# EAGLE board trig3_board_trigger_waveshare_lvds (EAGLE 9.6.2), part 1 of 2
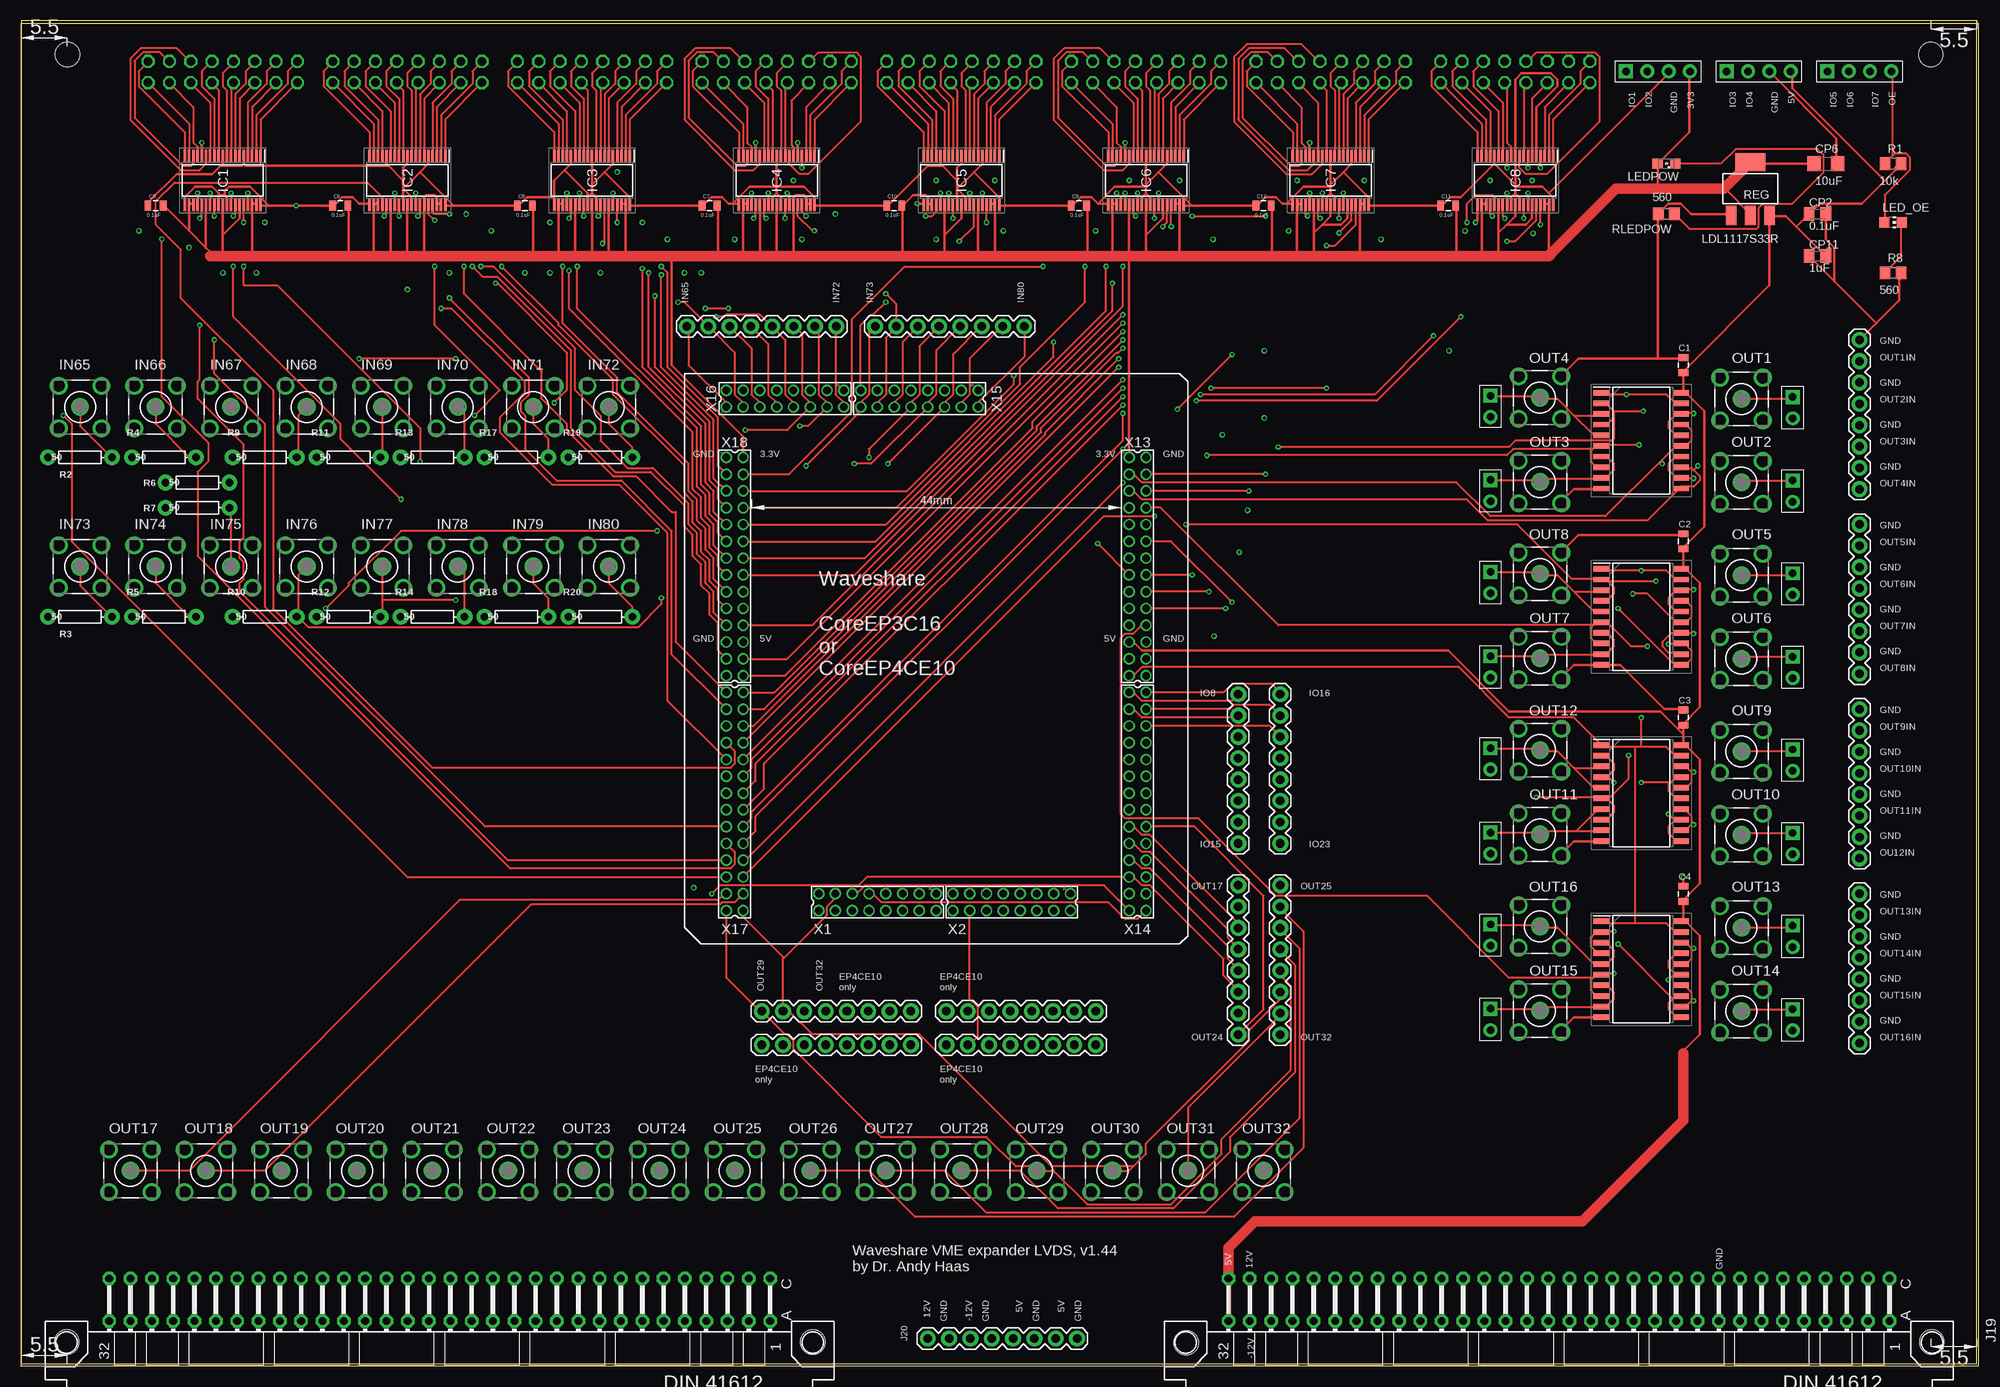
[diagram p3: board, top side]
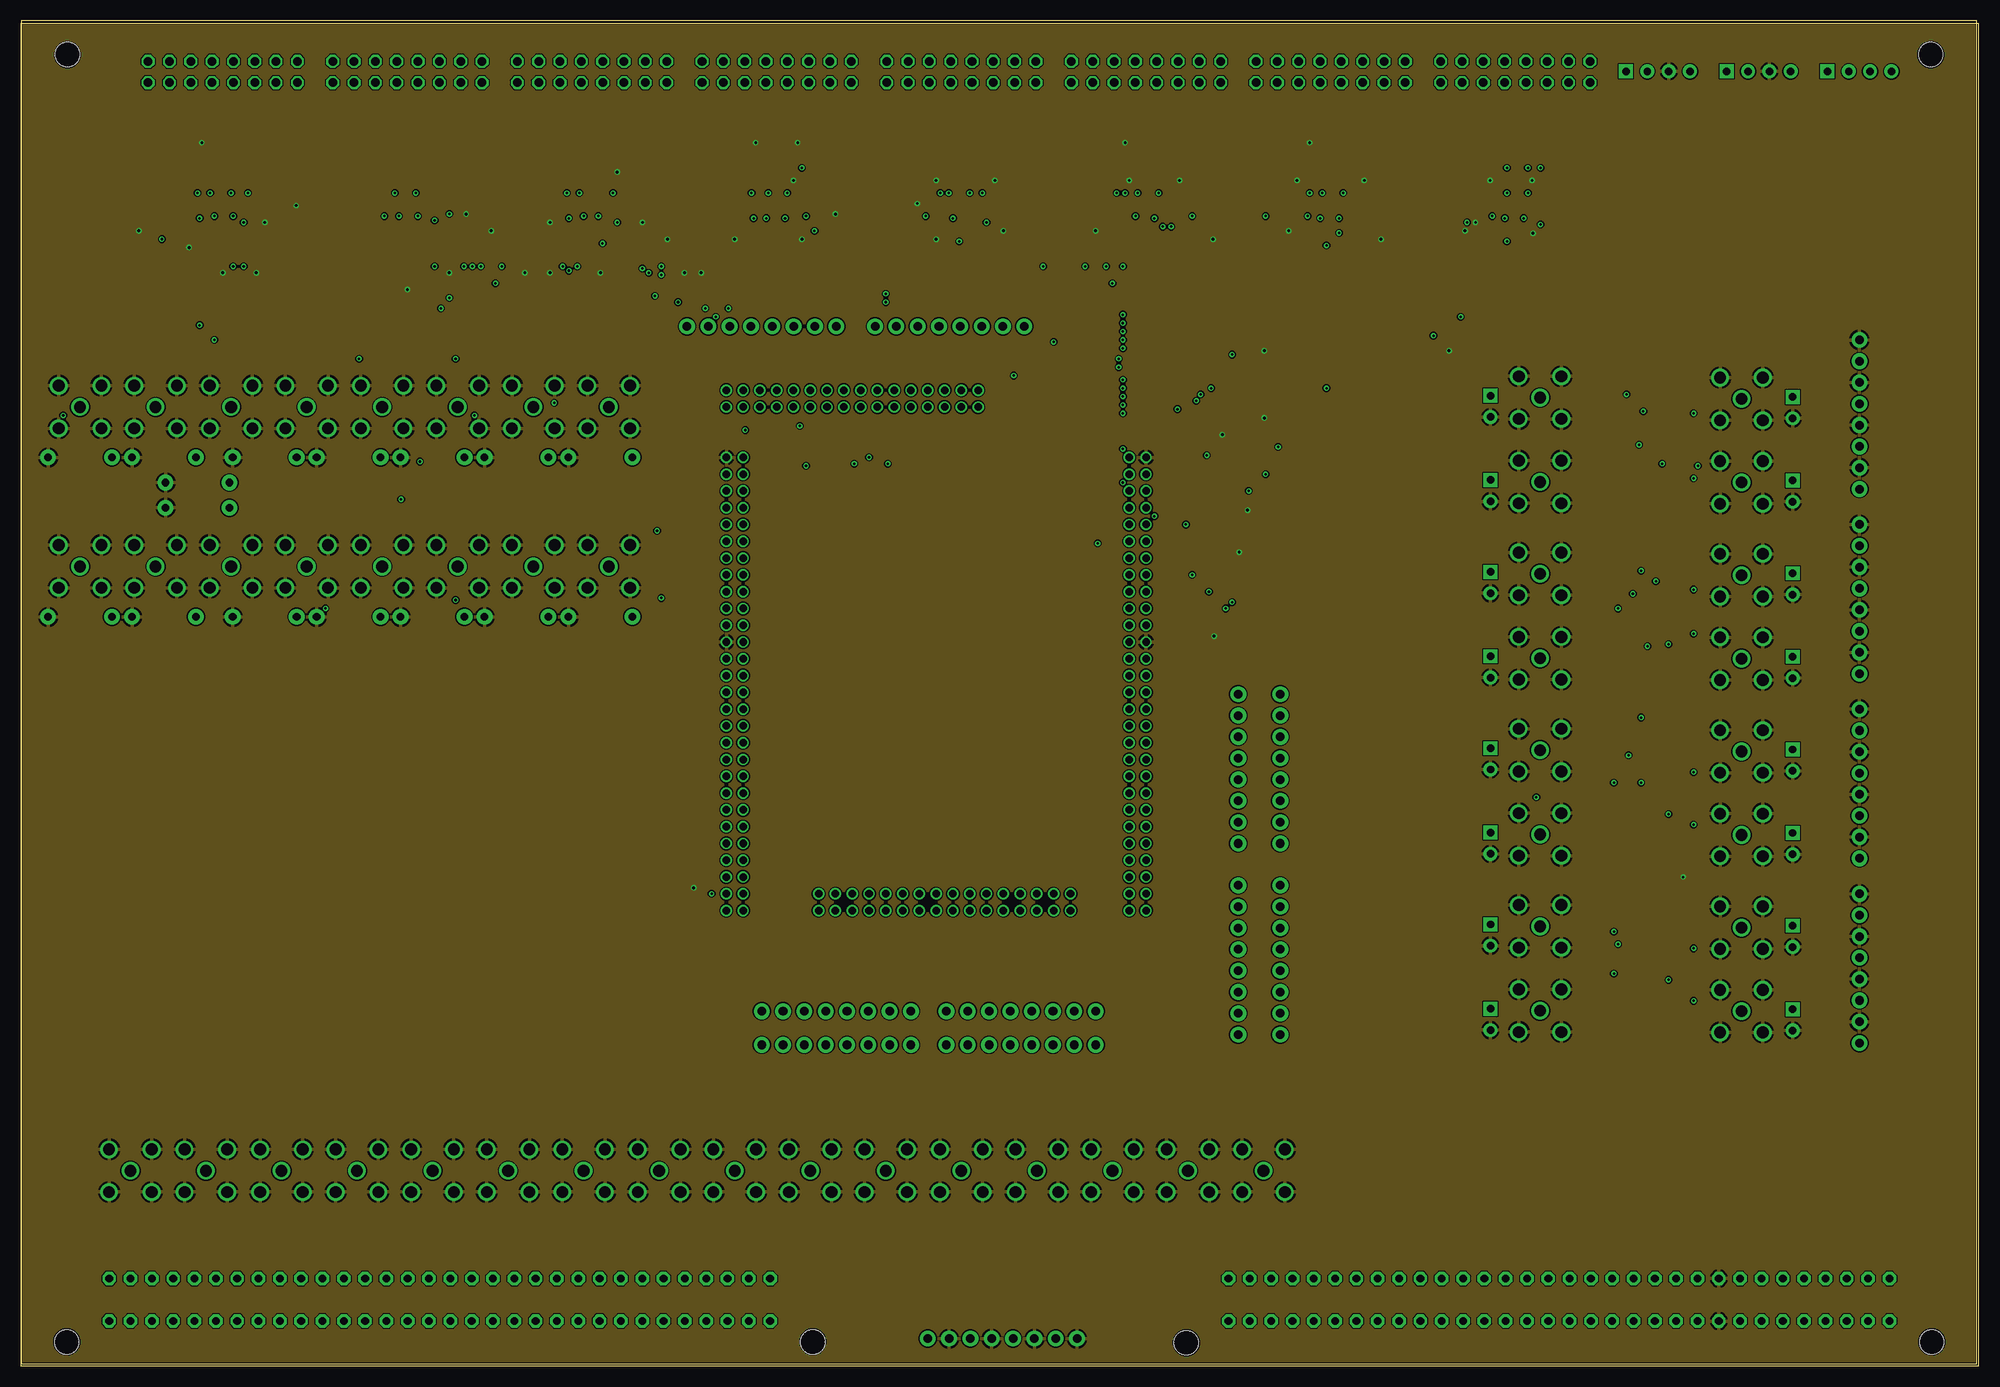
[diagram p4: board, inner layer topgnd]
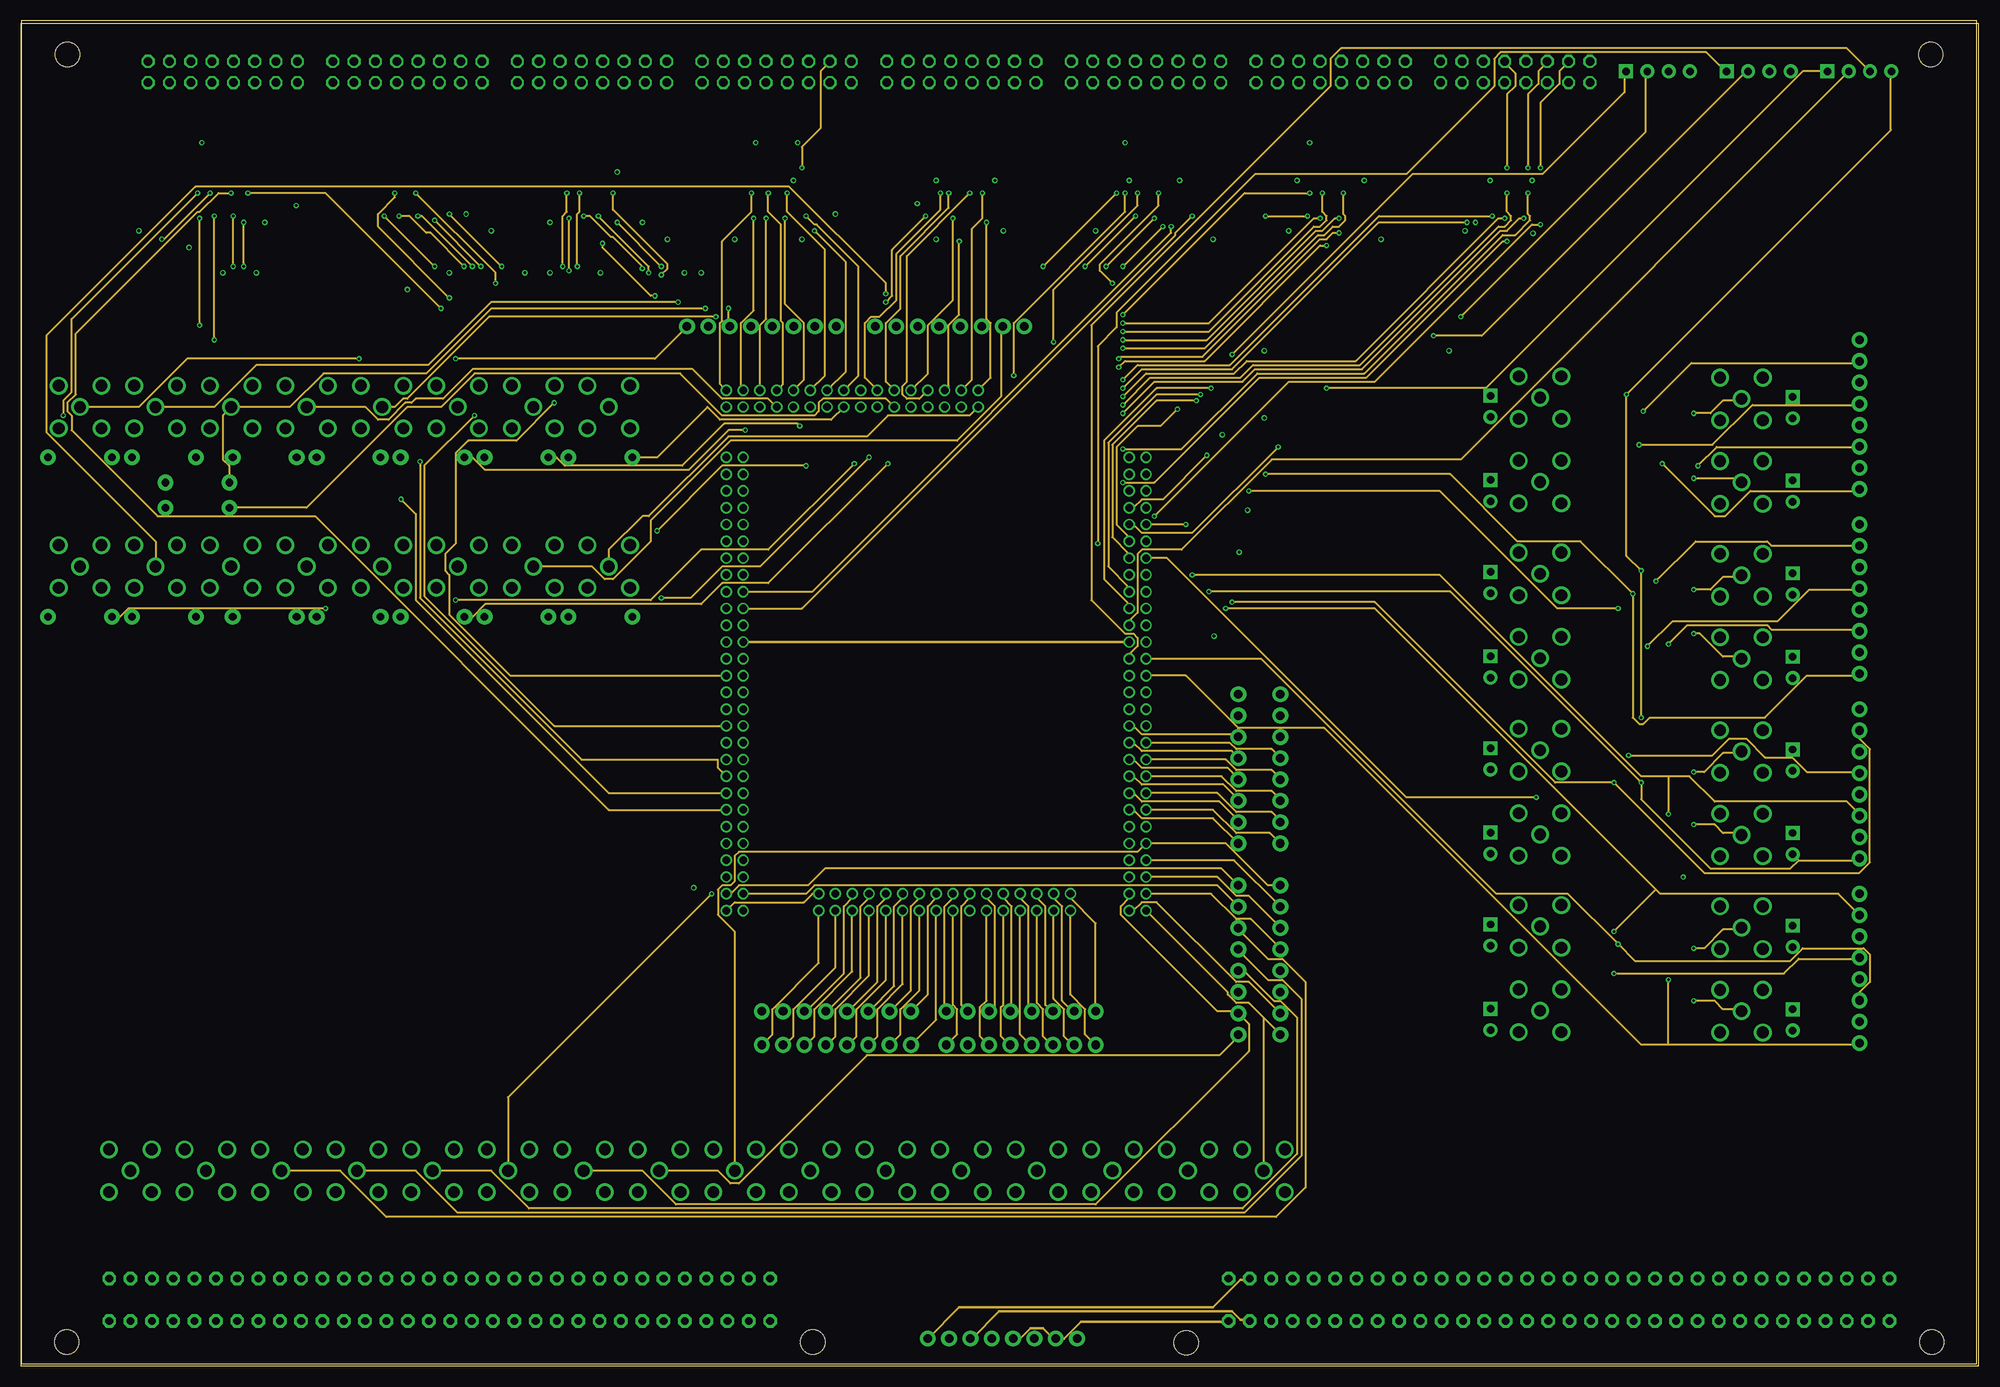
[diagram p5: board, inner layer route]
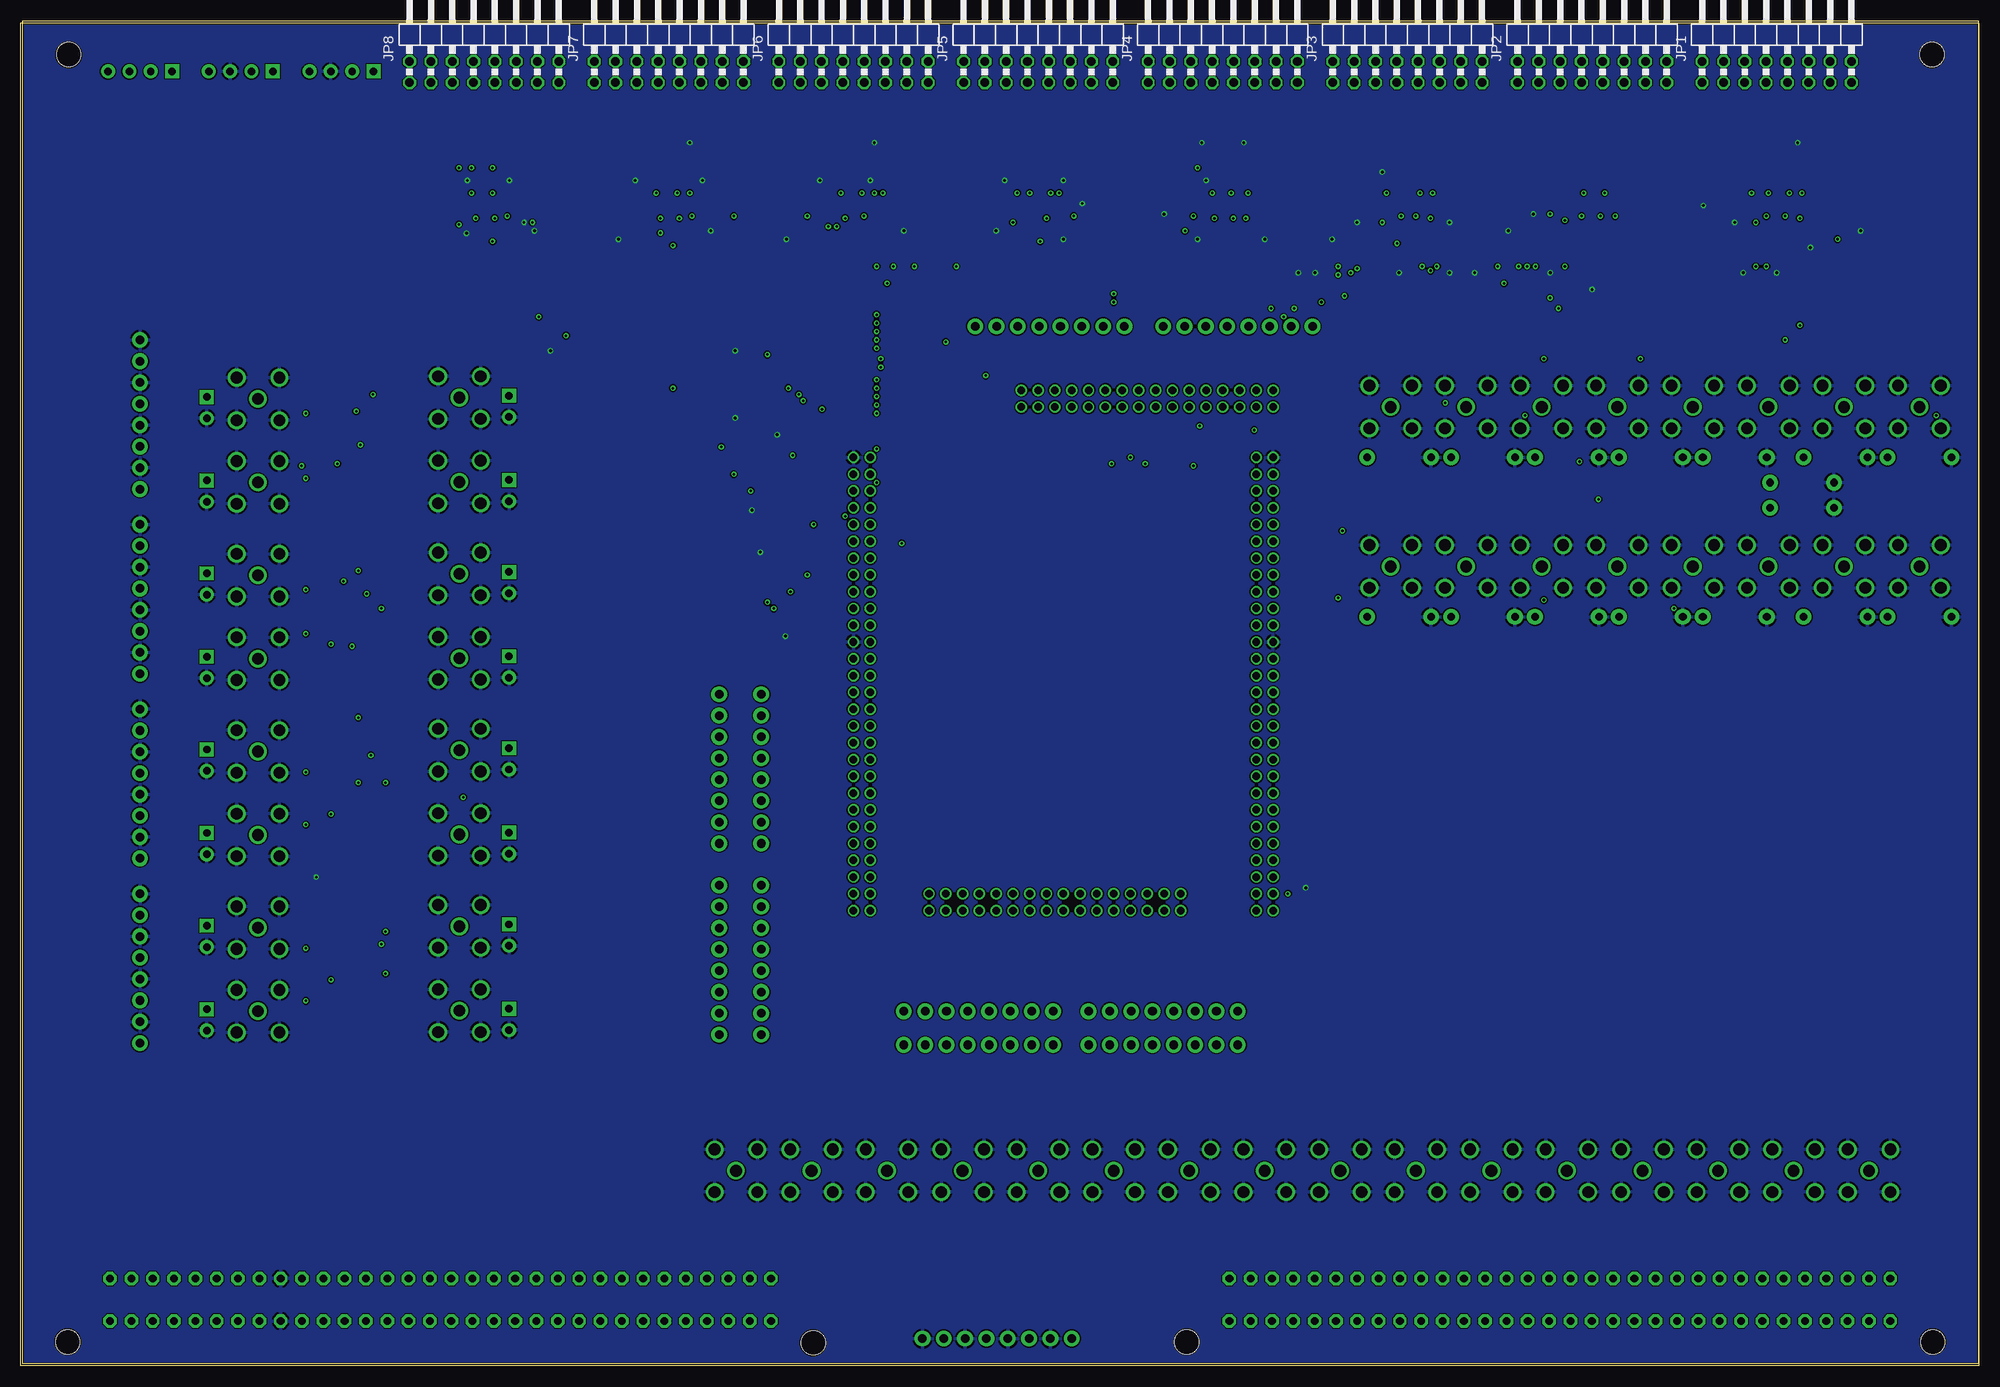
[diagram p6: board, bottom side, seen from below]

Size 233 x 160 mm. Coordinates in mm from the lower left corner, seen from the top.
Outline: 0,160 0,0 233,0 233,160 0,160
Copper layers (1*2*15*16): top 0.035mm / dielectric 0.2mm / topgnd 0.0175mm / dielectric 0.3mm / route 0.0175mm / dielectric 0.2mm / gnd 0.035mm
Design rules "Seeed_AllPCB_MacroFab_haas6mil": minimum track width 6mil, minimum drill 12mil, track to track 6mil, track to pad 6mil, pad to pad 6mil, via to via 6mil, smd to smd 0mil, copper to edge 6mil, drill to drill 6mil, minimum pad ring 6mil, minimum via ring 6mil, stop-mask expansion 6mil, vias tented up to drill 25mil, thermal gap 10mil
Net classes: 0 default: width 0.254 mm; 1 power: width 0.305 mm
Holes 2.9 mm at 5.4,2.6 138.8,2.5 227.6,2.6 94.3,2.6 5.5,156 227.5,156

## Footprints (pad centres in the part's own frame; a part is rotated, then mirrored left to right if it is on the bottom)
0805 = smd 0.8 x 1.2: 1 -0.9,0; 2 0.9,0
C0805K = smd 1.3 x 1.6: 1 -1,0; 2 1,0
C1206 = smd 1.6 x 1.8: 1 -1.4,0; 2 1.4,0
SOP50P640X120-38N = smd 1.475 x 0.3: 1 -2.938,4.5; 2 -2.938,4; 3 -2.938,3.5; 4 -2.938,3; 5 -2.938,2.5; 6 -2.938,2; 7 -2.938,1.5; 8 -2.938,1; 9 -2.938,0.5; 10 -2.938,0; 11 -2.938,-0.5; 12 -2.938,-1; 13 -2.938,-1.5; 14 -2.938,-2; 15 -2.938,-2.5; 16 -2.938,-3; 17 -2.938,-3.5; 18 -2.938,-4; 19 -2.938,-4.5; 20 2.938,-4.5; 21 2.938,-4; 22 2.938,-3.5; 23 2.938,-3; 24 2.938,-2.5; 25 2.938,-2; 26 2.938,-1.5; 27 2.938,-1; 28 2.938,-0.5; 29 2.938,0; 30 2.938,0.5; 31 2.938,1; 32 2.938,1.5; 33 2.938,2; 34 2.938,2.5; 35 2.938,3; 36 2.938,3.5; 37 2.938,4; 38 2.938,4.5
BU-SMB-V = drill 1.4: 1 0,0; 2 -2.54,2.54; 3 2.54,2.54; 4 2.54,-2.54; 5 -2.54,-2.54
1X08 = drill 1.016 pad 1.88: 1 0,0; 2 2.54,0; 3 5.08,0; 4 7.62,0; 5 10.16,0; 6 12.7,0; 7 15.24,0; 8 17.78,0
H4-2.54 = drill 0.889 pad 1.651 square: 1 0,3.81 | drill 0.889 pad 1.651: 2 0,1.27; 3 0,-1.27; 4 0,-3.81
6HE_160-VG64AC = drill 0.914 pad 1.6 octagon: 1-A1 5.08,11.43; 1-A2 5.08,16.51; 1-A3 5.08,13.97; 1-A4 5.08,19.05; 1-A5 5.08,21.59; 1-A6 5.08,24.13; 1-A7 5.08,26.67; 1-A8 5.08,29.21; 1-A9 5.08,31.75; 1-A10 5.08,34.29; 1-A11 5.08,36.83; 1-A12 5.08,39.37; 1-A13 5.08,41.91; 1-A14 5.08,44.45; 1-A15 5.08,46.99; 1-A16 5.08,49.53; 1-A17 5.08,52.07; 1-A18 5.08,54.61; 1-A19 5.08,57.15; 1-A20 5.08,59.69; 1-A21 5.08,62.23; 1-A22 5.08,64.77; 1-A23 5.08,67.31; 1-A24 5.08,69.85; 1-A25 5.08,72.39; 1-A26 5.08,74.93; 1-A27 5.08,77.47; 1-A28 5.08,80.01; 1-A29 5.08,82.55; 1-A30 5.08,85.09; 1-A31 5.08,87.63; 1-A32 5.08,90.17; 1-C1 10.16,11.43; 1-C2 10.16,13.97; 1-C3 10.16,16.51; 1-C4 10.16,19.05; 1-C5 10.16,21.59; 1-C6 10.16,24.13; 1-C7 10.16,26.67; 1-C8 10.16,29.21; 1-C9 10.16,31.75; 1-C10 10.16,34.29; 1-C11 10.16,36.83; 1-C12 10.16,39.37; 1-C13 10.16,41.91; 1-C14 10.16,44.45; 1-C15 10.16,46.99; 1-C16 10.16,49.53; 1-C17 10.16,52.07; 1-C18 10.16,54.61; 1-C19 10.16,57.15; 1-C20 10.16,59.69; 1-C21 10.16,62.23; 1-C22 10.16,64.77; 1-C23 10.16,67.31; 1-C24 10.16,69.85; 1-C25 10.16,72.39; 1-C26 10.16,74.93; 1-C27 10.16,77.47; 1-C28 10.16,80.01; 1-C29 10.16,82.55; 1-C30 10.16,85.09; 1-C31 10.16,87.63; 1-C32 10.16,90.17; 2-A1 5.08,144.78; 2-A2 5.08,147.32; 2-A3 5.08,149.86; 2-A4 5.08,152.4; 2-A5 5.08,154.94; 2-A6 5.08,157.48; 2-A7 5.08,160.02; 2-A8 5.08,162.56; 2-A9 5.08,165.1; 2-A10 5.08,167.64; 2-A11 5.08,170.18; 2-A12 5.08,172.72; 2-A13 5.08,175.26; 2-A14 5.08,177.8; 2-A15 5.08,180.34; 2-A16 5.08,182.88; 2-A17 5.08,185.42; 2-A18 5.08,187.96; 2-A19 5.08,190.5; 2-A20 5.08,193.04; 2-A21 5.08,195.58; 2-A22 5.08,198.12; 2-A23 5.08,200.66; 2-A24 5.08,203.2; 2-A25 5.08,205.74; 2-A26 5.08,208.28; 2-A27 5.08,210.82; 2-A28 5.08,213.36; 2-A29 5.08,215.9; 2-A30 5.08,218.44; 2-A31 5.08,220.98; 2-A32 5.08,223.52; 2-C1 10.16,144.78; 2-C2 10.16,147.32; 2-C3 10.16,149.86; 2-C4 10.16,152.4; 2-C5 10.16,154.94; 2-C6 10.16,157.48; 2-C7 10.16,160.02; 2-C8 10.16,162.56; 2-C9 10.16,165.1; 2-C10 10.16,167.64; 2-C11 10.16,170.18; 2-C12 10.16,172.72; 2-C13 10.16,175.26; 2-C14 10.16,177.8; 2-C15 10.16,180.34; 2-C16 10.16,182.88; 2-C17 10.16,185.42; 2-C18 10.16,187.96; 2-C19 10.16,190.5; 2-C20 10.16,193.04; 2-C21 10.16,195.58; 2-C22 10.16,198.12; 2-C23 10.16,200.66; 2-C24 10.16,203.2; 2-C25 10.16,205.74; 2-C26 10.16,208.28; 2-C27 10.16,210.82; 2-C28 10.16,213.36; 2-C29 10.16,215.9; 2-C30 10.16,218.44; 2-C31 10.16,220.98; 2-C32 10.16,223.52
2X08/90 = drill 1.016 octagon: 1 -8.89,-6.35; 2 -8.89,-3.81; 3 -6.35,-6.35; 4 -6.35,-3.81; 5 -3.81,-6.35; 6 -3.81,-3.81; 7 -1.27,-6.35; 8 -1.27,-3.81; 9 1.27,-6.35; 10 1.27,-3.81; 11 3.81,-6.35; 12 3.81,-3.81; 13 6.35,-6.35; 14 6.35,-3.81; 15 8.89,-6.35; 16 8.89,-3.81
CHIP-LED0805 = smd 1.2 x 1.2: A 0,-1.05; C 0,1.05
SML0805 = smd 1.2 x 1.2: A 1.05,0; C -1.05,0
H2-2.54 = drill 0.889 pad 1.651 square: 1 0,1.27 | drill 0.889 pad 1.651: 2 0,-1.27
R0805 = smd 1.3 x 1.5: 1 -0.95,0; 2 0.95,0
AXIAL-0.3 = drill 0.9 pad 1.88: P$1 -3.81,0; P$2 3.81,0
SOT-223 = smd 1.27 x 2.286: 1 -2.286,-3.175; 2 0,-3.175; 3 2.286,-3.175 | smd 3.556 x 2.159: TER 0,3.175
SOIC127P1030X265-20N = smd 1.95 x 0.65: 1 -4.725,5.715; 2 -4.725,4.445; 3 -4.725,3.175; 4 -4.725,1.905; 5 -4.725,0.635; 6 -4.725,-0.635; 7 -4.725,-1.905; 8 -4.725,-3.175; 9 -4.725,-4.445; 10 -4.725,-5.715; 11 4.725,-5.715; 12 4.725,-4.445; 13 4.725,-3.175; 14 4.725,-1.905; 15 4.725,-0.635; 16 4.725,0.635; 17 4.725,1.905; 18 4.725,3.175; 19 4.725,4.445; 20 4.725,5.715
87758-1616 = drill 0.9 pad 1.27: 1 -7,-1; 2 -7,1; 3 -5,-1; 4 -5,1; 5 -3,-1; 6 -3,1; 7 -1,-1; 8 -1,1; 9 1,-1; 10 1,1; 11 3,-1; 12 3,1; 13 5,-1; 14 5,1; 15 7,-1; 16 7,1
87758-2816 = drill 0.9 pad 1.27: 1 -13,-1; 2 -13,1; 3 -11,-1; 4 -11,1; 5 -9,-1; 6 -9,1; 7 -7,-1; 8 -7,1; 9 -5,-1; 10 -5,1; 11 -3,-1; 12 -3,1; 13 -1,-1; 14 -1,1; 15 1,-1; 16 1,1; 17 3,-1; 18 3,1; 19 5,-1; 20 5,1; 21 7,-1; 22 7,1; 23 9,-1; 24 9,1; 25 11,-1; 26 11,1; 27 13,-1; 28 13,1

## Placement (x,y rotation side)
C1  0.1uF  [0805]  198,119 270 top
C2  0.1uF  [0805]  198,98 270 top
C3  0.1uF  [0805]  198,77 270 top
C4  0.1uF  [0805]  198,56 270 top
C5  0.1uF  [0805]  16,138 0 top
C6  0.1uF  [0805]  38,138 0 top
C7  0.1uF  [0805]  82,138 0 top
C8  0.1uF  [0805]  60,138 0 top
C9  0.1uF  [0805]  126,138 0 top
C10  0.1uF  [0805]  104,138 0 top
C11  0.1uF  [0805]  170,138 0 top
C12  0.1uF  [0805]  148,138 0 top
CP2  0.1uF  [C0805K]  214,137 0 top
CP6  10uF  [C1206]  215,143 0 top
CP11  1uF  [C0805K]  214,132 0 top
IC1  SN65LVDT388ADBT  [SOP50P640X120-38N]  24,141 270 top
IC2  SN65LVDT388ADBT  [SOP50P640X120-38N]  46,141 270 top
IC3  SN65LVDT388ADBT  [SOP50P640X120-38N]  68,141 270 top
IC4  SN65LVDT388ADBT  [SOP50P640X120-38N]  90,141 270 top
IC5  SN65LVDT388ADBT  [SOP50P640X120-38N]  112,141 270 top
IC6  SN65LVDT388ADBT  [SOP50P640X120-38N]  134,141 270 top
IC7  SN65LVDT388ADBT  [SOP50P640X120-38N]  156,141 270 top
IC8  SN65LVDT388ADBT  [SOP50P640X120-38N]  178,141 270 top
IN65  BU-SMB-V  [BU-SMB-V]  7,114 0 top
IN66  BU-SMB-V  [BU-SMB-V]  16,114 0 top
IN67  BU-SMB-V  [BU-SMB-V]  25,114 0 top
IN68  BU-SMB-V  [BU-SMB-V]  34,114 0 top
IN69  BU-SMB-V  [BU-SMB-V]  43,114 0 top
IN70  BU-SMB-V  [BU-SMB-V]  52,114 0 top
IN71  BU-SMB-V  [BU-SMB-V]  61,114 0 top
IN72  BU-SMB-V  [BU-SMB-V]  70,114 0 top
IN73  BU-SMB-V  [BU-SMB-V]  7,95 0 top
IN74  BU-SMB-V  [BU-SMB-V]  16,95 0 top
IN75  BU-SMB-V  [BU-SMB-V]  25,95 0 top
IN76  BU-SMB-V  [BU-SMB-V]  34,95 0 top
IN77  BU-SMB-V  [BU-SMB-V]  43,95 0 top
IN78  BU-SMB-V  [BU-SMB-V]  52,95 0 top
IN79  BU-SMB-V  [BU-SMB-V]  61,95 0 top
IN80  BU-SMB-V  [BU-SMB-V]  70,95 0 top
J1  8pin  [1X08]  219,122 270 top
J2  8pin  [1X08]  219,78 270 top
J3  4p-2.54  [H4-2.54]  219,154 90 top
J4  4p-2.54  [H4-2.54]  207,154 90 top
J5  8pin  [1X08]  219,56 270 top
J6  8pin  [1X08]  219,100 270 top
J7  8pin  [1X08]  97.1,123.6 180 top
J8  8pin  [1X08]  119.5,123.6 180 top
J9  8pin  [1X08]  106,42 180 top
J10  8pin  [1X08]  128,42 180 top
J11  8pin  [1X08]  106,38 180 top
J12  4p-2.54  [H4-2.54]  195,154 90 top
J13  8pin  [1X08]  128,38 180 top
J14  8pin  [1X08]  145,62 90 top
J15  8pin  [1X08]  150,62 90 top
J16  8pin  [1X08]  150,57 270 top
J17  8pin  [1X08]  145,57 270 top
J19  6HE-160-VG64AC  [6HE_160-VG64AC]  234,0 90 top
J20  8pin  [1X08]  108,3 0 top
JP1  16  [2X08/90]  24,159 0 bottom
JP2  16  [2X08/90]  46,159 0 bottom
JP3  16  [2X08/90]  68,159 0 bottom
JP4  16  [2X08/90]  90,159 0 bottom
JP5  16  [2X08/90]  112,159 0 bottom
JP6  16  [2X08/90]  134,159 0 bottom
JP7  16  [2X08/90]  156,159 0 bottom
JP8  16  [2X08/90]  178,159 0 bottom
LED_OE  OutputEn  [CHIP-LED0805]  223,136 270 top
LEDPOW  MF-LED-0805-RED  [SML0805]  196,143 180 top
OJ1  2p-2.54  [H2-2.54]  211.04,113.93 0 top
OJ2  2p-2.54  [H2-2.54]  211.04,103.98 0 top
OJ3  2p-2.54  [H2-2.54]  175.04,104.03 0 top
OJ4  2p-2.54  [H2-2.54]  175.04,114.08 0 top
OJ9  2p-2.54  [H2-2.54]  175.04,93.08 0 top
OJ10  2p-2.54  [H2-2.54]  175.04,83.03 0 top
OJ11  2p-2.54  [H2-2.54]  211.04,82.98 0 top
OJ12  2p-2.54  [H2-2.54]  211.04,92.93 0 top
OJ13  2p-2.54  [H2-2.54]  175.04,72.08 0 top
OJ14  2p-2.54  [H2-2.54]  175.04,62.03 0 top
OJ15  2p-2.54  [H2-2.54]  211.04,61.98 0 top
OJ16  2p-2.54  [H2-2.54]  211.04,71.93 0 top
OJ17  2p-2.54  [H2-2.54]  175.04,51.08 0 top
OJ18  2p-2.54  [H2-2.54]  175.04,41.03 0 top
OJ19  2p-2.54  [H2-2.54]  211.04,40.98 0 top
OJ20  2p-2.54  [H2-2.54]  211.04,50.93 0 top
OUT1  BU-SMB-V  [BU-SMB-V]  204.95,114.96 90 top
OUT2  BU-SMB-V  [BU-SMB-V]  204.95,105.02 90 top
OUT3  BU-SMB-V  [BU-SMB-V]  180.95,105.07 90 top
OUT4  BU-SMB-V  [BU-SMB-V]  180.95,115.12 90 top
OUT5  BU-SMB-V  [BU-SMB-V]  204.95,93.96 90 top
OUT6  BU-SMB-V  [BU-SMB-V]  204.95,84.02 90 top
OUT7  BU-SMB-V  [BU-SMB-V]  180.95,84.07 90 top
OUT8  BU-SMB-V  [BU-SMB-V]  180.95,94.12 90 top
OUT9  BU-SMB-V  [BU-SMB-V]  204.95,72.96 90 top
OUT10  BU-SMB-V  [BU-SMB-V]  204.95,63.02 90 top
OUT11  BU-SMB-V  [BU-SMB-V]  180.95,63.07 90 top
OUT12  BU-SMB-V  [BU-SMB-V]  180.95,73.12 90 top
OUT13  BU-SMB-V  [BU-SMB-V]  204.95,51.96 90 top
OUT14  BU-SMB-V  [BU-SMB-V]  204.95,42.02 90 top
OUT15  BU-SMB-V  [BU-SMB-V]  180.95,42.07 90 top
OUT16  BU-SMB-V  [BU-SMB-V]  180.95,52.12 90 top
OUT17  BU-SMB-V  [BU-SMB-V]  13,23 0 top
OUT18  BU-SMB-V  [BU-SMB-V]  22,23 0 top
OUT19  BU-SMB-V  [BU-SMB-V]  31,23 0 top
OUT20  BU-SMB-V  [BU-SMB-V]  40,23 0 top
OUT21  BU-SMB-V  [BU-SMB-V]  49,23 0 top
OUT22  BU-SMB-V  [BU-SMB-V]  58,23 0 top
OUT23  BU-SMB-V  [BU-SMB-V]  67,23 0 top
OUT24  BU-SMB-V  [BU-SMB-V]  76,23 0 top
OUT25  BU-SMB-V  [BU-SMB-V]  85,23 0 top
OUT26  BU-SMB-V  [BU-SMB-V]  94,23 0 top
OUT27  BU-SMB-V  [BU-SMB-V]  103,23 0 top
OUT28  BU-SMB-V  [BU-SMB-V]  112,23 0 top
OUT29  BU-SMB-V  [BU-SMB-V]  121,23 0 top
OUT30  BU-SMB-V  [BU-SMB-V]  130,23 0 top
OUT31  BU-SMB-V  [BU-SMB-V]  139,23 0 top
OUT32  BU-SMB-V  [BU-SMB-V]  148,23 0 top
R1  10k  [R0805]  223,143 0 top
R2  50  [AXIAL-0.3]  7,108 0 top
R3  50  [AXIAL-0.3]  7,89 0 top
R4  50  [AXIAL-0.3]  17,108 0 top
R5  50  [AXIAL-0.3]  17,89 0 top
R6  50  [AXIAL-0.3]  21,105 0 top
R7  50  [AXIAL-0.3]  21,102 0 top
R8  560  [R0805]  223,130 0 top
R9  50  [AXIAL-0.3]  29,108 0 top
R10  50  [AXIAL-0.3]  29,89 0 top
R11  50  [AXIAL-0.3]  39,108 0 top
R12  50  [AXIAL-0.3]  39,89 0 top
R13  50  [AXIAL-0.3]  49,108 0 top
R14  50  [AXIAL-0.3]  49,89 0 top
R17  50  [AXIAL-0.3]  59,108 0 top
R18  50  [AXIAL-0.3]  59,89 0 top
R19  50  [AXIAL-0.3]  69,108 0 top
R20  50  [AXIAL-0.3]  69,89 0 top
REG  LDL1117S33R  [SOT-223]  206,140 0 top
RLEDPOW  560  [R0805]  196,137 180 top
VSLUE  SN74ACT244DW  [SOIC127P1030X265-20N]  193,110 0 top
VSLUE2  SN74ACT244DW  [SOIC127P1030X265-20N]  193,89 0 top
VSLUE3  SN74ACT244DW  [SOIC127P1030X265-20N]  193,68 0 top
VSLUE4  SN74ACT244DW  [SOIC127P1030X265-20N]  193,47 0 top
X1  87758-1616  [87758-1616]  102,55 0 top
X2  87758-1616  [87758-1616]  118,55 0 top
X13  87758-2816  [87758-2816]  133,95 270 top
X14  87758-2816  [87758-2816]  133,67 270 top
X15  87758-1616  [87758-1616]  107,115 0 top
X16  87758-1616  [87758-1616]  91,115 0 top
X17  87758-2816  [87758-2816]  85,67 270 top
X18  87758-2816  [87758-2816]  85,95 270 top

## Tracks (layer width: path | path; a pad name or v marks a point on that pad's centre or on a via)
3V3
  top 0.305: IC8.36 181.5,138.25 182,138.25 IC8.37 182,132.75 182.38,132.38 | IC8.22 174.5,138.25 174,138.25 IC8.21 174,132 | IC7.37 160,138.25 159.5,138.25 IC7.36 159.5,132 | IC7.22 152.5,138.25 152,138.25 IC7.21 152,132 | IC6.36 137.5,138.25 138,138.25 IC6.37 138,132 | IC6.22 130.5,138.25 130,138.25 IC6.21 130,132 | IC5.36 115.5,138.25 116,138.25 IC5.37 116,132 | 108,138.25 108.5,138.25 IC5.22 | 93.5,138.25 94,138.25 IC4.37 | IC4.22 86.5,138.25 86,138.25 IC4.21 86,132 | IC3.36 71.5,138.25 72,138.25 IC3.37 72,132 | IC3.22 64.5,138.25 64,138.25 IC3.21 64,132 | 49.5,138.25 50,138.25 IC2.37 | IC2.22 42.5,138.25 42,138.25 IC2.21 42,132 | IC1.37 28,138.25 27.5,138.25 IC1.36 27.5,132 | IC1.22 20.5,138.25 20,138.25 IC1.21 20,135 | 22,133 22.5,132.5 22.5,132 | 22,133 20,135 | 20,135 17,138 C5.2 | 39,132 39,138 C6.2 | 61,132 61,138 C8.2 | 83,132 83,138 C7.2 | 105,132 105,138 | 127,132 127,138 C9.2 | 149,132 149,138 C12.2 | 171,132 171,138 C11.2 | 195,140 195,143 | 22,133 IC1.25 | 24,132 24,134.5 | 24,134.5 IC1.29 | IC1.33 26,136.5 24,134.5 | 44,132 IC2.25 | 46,132 IC2.29 | 48,132 IC2.33 48,139 48.25,139.25 49.25,139.25 49.5,139 49.5,138.25 | 66,132 IC3.25 | 68,132 IC3.29 | 70,132 IC3.33 | 88,132 IC4.25 | 90,132 IC4.29 | 92,132 IC4.33 92,139 92.25,139.25 93.25,139.25 93.5,139 93.5,138.25 | 110,132 110,134.5 | 110,134.5 IC5.25 | IC5.29 112,136.5 110,134.5 | 114,132 IC5.33 | IC6.25 132,132 X13.1 | 134,132 134,134.5 | 134,134.5 IC6.29 | IC6.33 136,136.5 134,134.5 | 154,132 154,134.75 | 154,134.75 IC7.25 | IC7.29 156,136.75 155,135.75 | 154,134.75 155,135.75 | IC7.33 158,136.5 157.25,135.75 155,135.75 | 176,132 176,134.75 | 176,134.75 IC8.25 | IC8.29 178,136.75 177,135.75
  top 0.305: 176,134.75 177,135.75 | IC8.33 180,136.5 179.25,135.75 177,135.75 | 49.5,138.25 IC2.36 | 93.5,138.25 IC4.36 | 108,138.25 108,139 107.75,139.25 106.25,139.25 105,138 | 108,138.25 IC5.21 | 105,138 C10.2 | CP6.1 206.5,143 REG.TER | REG.2 206,137 203.25,139.75 202.82,140 | X18.2 86,110.5 77.5,119 77.5,132 | 195,143 198.75,146.75 198.75,154 J12.4 | 195,143 LEDPOW.A
  top 1.27: REG.TER 202.82,140 195,140 190,140 182.38,132.38 182,132 176,132 174,132 171,132 159.5,132 154,132 152,132 149,132 138,132 134,132 132,132 130,132 127,132 116,132 114,132 110,132 105,132 92,132 90,132 88,132 86,132 83,132 77.5,132 72,132 70,132 68,132 66,132 64,132 61,132 48,132 46,132 44,132 42,132 39,132 27.5,132 24,132 22.5,132
5V
  top 0.305: 222,141 219.25,138.25 214.25,138.25 CP2.1 211.5,135.5 | 222,141 223.25,142.25 223.25,142.5 223.75,143 R1.2 | 222,141 211,152 211,154 J4.4 | 198,116 C1.2 198,118.25 208.25,128.5 208.25,136.75 REG.3 208.5,136.75 210.25,136.75 211.5,135.5 | 198,116 197.75,115.75 VSLUE.20 198,116 | 211.5,135.5 CP11.2 | 198,74 198,75 | 198,75 C3.2 198,76.25 200,78.25 200,93 198,95 | 198,74 197.75,73.75 VSLUE3.20 198,74 | 198,95 C2.2 198,97.25 200.5,99.75 200.5,113.5 198,116 | 198,95 197.75,94.75 VSLUE2.20 198,95 | 198,53 C4.2 198,55.25 200,57.25 200,72 198,74 | 198,53 197.75,52.75 VSLUE4.20 198,53 | 198,53 200,51 200,39.25 198.25,37.5 198,37 | J19.1-A32 144,5.25 144,9.75 J19.1-C32 | X13.23 132.5,86 133.5,85 170,85 177.25,77.75 195.25,77.75 198,75
  top 1.27: J19.1-C32 143.83,13.83 147,17 186,17 198,29 198,37
  route 0.305: X13.23 X18.24 | J20.5 119,3 120.25,4.25 121.75,4.25 123,3 J20.7 124.25,3 126.25,5 143.75,5 J19.1-A32
12V
  route 0.305: J20.1 111.75,6.75 142,6.75 145.25,10 146.25,10 J19.1-C31
-12V
  route 0.305: J19.1-A31 146.25,5.25 145.25,5.25 144.25,6.25 116.5,6.25 113.25,3 J20.3
GND  (via drill 0.3, 0.35)
  top 0.305: IC8.28 177.5,139 178,139.5 | 178,140.5 IC8.10 178,153 178.75,153.75 182.25,153.75 183,153 183,152.25 180.5,149.75 IC8.5 | 178,140.5 178,140.25 | 178,140.25 178,139.5 | IC8.30 178.5,139 178,139.5 | 175.5,143 IC8.15 | 178,140.5 175.5,143 | IC8.38 182.5,139 182,139.5 | 182,139.5 181.25,140.25 178,140.25 | IC7.28 155.5,139 156,139.5 | IC7.10 156,140.5 | 156,140.5 156,140.25 | 156,140.25 156,139.5 | IC7.30 156.5,139 156,139.5 | IC7.5 158.5,143 157.5,142 | 156,140.5 157.5,142 | 157.5,142 160.5,139 IC7.38 160.5,138 C11.1 169.25,138 170.25,139 171.5,139 175.5,143 | IC6.28 133.5,139 134,139.5 | IC6.10 134,140.5 | 134,140.5 134,140.25 | 134,140.25 134,139.5 | IC6.30 134.5,139 134,139.5 | IC6.5 136.5,143 135.5,142 | 134,140.5 135.5,142 | 139.5,138 138.5,138 IC6.38 | 139.5,138 C12.1 147.25,138 148.25,139 149.5,139 150.25,138.25 150.75,138.25 | 150.75,138.25 151.5,138.25 IC7.20 | 139.5,138 135.5,142 | 156,140.25 152.75,140.25 150.75,138.25 | 128.25,138.25 129.5,138.25 IC6.20 | 128.25,138.25 127.5,139 126.25,139 125.25,138 C9.1 116.5,138 IC5.38 116.5,139 113.5,142 | 111.5,141 111.5,142.5 112,143 IC5.10 | 111.5,141 111.5,140 | 111.5,140 IC5.28 | IC5.30 112.5,139 111.5,140 | IC5.15 109.5,143 109.75,142.75 | 111.5,141 109.75,142.75 | IC5.5 114.5,143 113.5,142 | 111.5,140 113.5,142 | 109.75,142.75 108,142.75 103.25,138 C10.1 94.5,138 IC4.38 94.5,139 93.25,140.25 90,140.25 | IC4.28 89.5,139 90,139.5 | IC4.10 90,140.25 | 90,140.25 90,139.5 | IC4.30 90.5,139 90,139.5 | 84.75,138.25 84.25,138.25 83.5,139 82.25,139 81.25,138 C7.1 72.5,138 IC3.38 72.5,139 69.5,142 | 84.75,138.25 85.5,138.25 IC4.20 | 90,140.25 86.75,140.25 84.75,138.25 | 23.75,142.75 24,143 IC1.10
  top 0.305: 23.75,142.75 22.75,141.75 18.5,141.75 15.25,138.5 15.25,138 C5.1 | 26.5,143 IC1.5 | 26.5,143 26.25,142.75 23.75,142.75 | 45.5,141 45.5,142.5 46,143 IC2.10 | 45.5,141 45.5,140 | 45.5,140 IC2.28 | IC2.30 46.5,139 45.5,140 | IC2.15 43.5,143 43.75,142.75 | 45.5,141 43.75,142.75 | IC2.5 48.5,143 47.5,142 | 45.5,140 47.5,142 | 51.5,138 50.5,138 IC2.38 | 51.5,138 C8.1 59.25,138 60.25,139 63.5,139 | 63.5,139 63.5,141 64.75,142.25 | 63.5,139 IC3.20 | 64.75,142.25 65.5,143 IC3.15 | 67.5,139.25 67.5,139.5 64.75,142.25 | 67.5,139.25 IC3.28 | IC3.30 68.5,139 68.25,139.25 68,139.25 | 67.5,139.25 68,139.25 | 68,139.25 68,140.5 | 68,140.5 IC3.10 | IC3.5 70.5,143 69.5,142 | 68,140.5 69.5,142 | 51.5,138 47.5,142 | 26.5,143 26.75,142.75 43.75,142.75 | 134,140.25 130.25,140.25 128.25,138.25 | IC1.20 19.5,139 20.75,140.25 22.75,140.25 23.5,139.5 23.5,139.25 | IC1.28 23.5,139.25 | IC1.30 24.5,139 24.25,139.25 | 23.5,139.25 24.25,139.25 | 29.5,138 28.5,138 IC1.38 | 29.5,138 v32.75,138 C6.1 37.25,138 38.25,139 39.5,139 40.25,138.25 41.5,138.25 IC2.20 | 24.25,139.25 24.25,139.75 24.75,140.25 27.25,140.25 29.5,138 | C3.1 198,78 195.75,78 190.5,83.25 188.5,83.25 VSLUE2.10 188.25,83.25 185,83.25 183.5,81.75 OUT7.5 | v198,58 C4.1 | C2.1 198,98.75 185.5,98.75 183.5,96.75 OUT8.4 | 195,119.75 185.5,119.75 183.5,117.75 OUT4.4 | 195,119.75 198,119.75 C1.1 | v21.5,145.5 IC1.15 | v87.5,145.5 IC4.15 | v92.5,145.5 IC4.5 | v106.75,138.25 107.5,138.25 IC5.20 | v131.5,145.5 IC6.15 | v153.5,145.5 IC7.15 | IC8.20 173.5,136.25 v173.25,136 | J1.1 221,124 | 221,124 223.75,126.75 223.75,130 R8.2 | 195,119.75 195,137 | 221,124 216,129 | 216,129 CP11.1 | CP2.2 215,134 216,133 216,129
  top 0.305: CP6.2 216.25,143 216.25,146 208.25,154 J4.3 | VSLUE4.10 188.25,41.25 185,41.25 183.5,39.75 OUT15.5 | VSLUE3.10 188.25,62.25 185,62.25 183.5,60.75 OUT11.5 | VSLUE.10 188.25,104.25 185,104.25 183.5,102.75 OUT3.5 | 195,137 196.25,138.25 197.75,138.25 199,137 203.5,137 REG.1 | 195,137 RLEDPOW.2 | 182,139.5 196.5,154 J12.3
  other vias: 28,130 24,130 20,133 14,135 29,136 46,128 51,130 53,137 56,135 60,130 63,136 63,130 69,130 74,136 77,134 81,130 79,130 85,134 93,134 97,137 92,141 71,142 109,141 116,141 132,141 138,141 152,141 160,141 175,141 180,141 109,134 117,135 128,135 142,134 151,135 162,134 172,135 180.1,134.7 148.1,120.7 170.1,120.7 148.1,112.7 143.1,110.7 146.1,101.7 145.1,96.7 142.1,86.7 80.1,56.7
  pour gnd: 235,162 235,-2 -2,-2 -2,162
  pour topgnd: 237,164 237,-4 -4,-4 -4,164
IN1  (via drill 0.3)
  top 0.254: v21,139.5 IC1.23 | X17.23 46,58 6,98 6,112 v5,113
  route 0.254: v21,139.5 6,124.5 6,115.75 5,114.75 v5,113
IN2  (via drill 0.3)
  top 0.254: IC1.24 21.5,136.75 v21.25,136.5 | v21.25,123.75 21.25,117.25 21,117 21,115 26.5,109.5 26.5,98.5 26,98 26,96 26.5,95.5 26.5,93.5 26,93 26,92 58,60 X17.21
  route 0.254: v21.25,123.75 v21.25,136.5
IN3  (via drill 0.3)
  top 0.254: v22.5,139.5 IC1.26 | v16.75,134 16.75,115.25 22.25,109.75 22.25,107.5 21,106.25 21,96.25 58.25,59 84.5,59 85,59.5 85,61 X17.19
  route 0.254: v22.5,139.5 17,134 v16.75,134
IN4  (via drill 0.3)
  top 0.254: v23,136.75 IC1.27 | v23,122 23,118 29,112 29,90.25 55.25,64 X17.17
  route 0.254: v23,122 v23,136.75
IN5  (via drill 0.3)
  top 0.254: v25,139.5 IC1.31
  route 0.254: v25,139.5 23.5,139.5 21.25,137.25 21,137.25 6.5,122.75 6.5,115.5 5.5,114.5 5.5,113.5 6,113 6,111.25 16.25,101 35,101 70,66 X17.15
IN6  (via drill 0.3)
  top 0.254: IC1.32 25.5,137 v25.25,136.75 | v25.25,130.75 25.25,124.75 38,112 38,110.25 v45.25,103
  route 0.254: v25.25,130.75 v25.25,136.75 | X17.13 70,68 47,91 47,101.25 v45.25,103
IN7  (via drill 0.3)
  top 0.254: v26.5,136 IC1.34 | v26.5,130.75 26.5,128.5 30.5,128.5 47.5,111.5 v47.5,107.5
  route 0.254: v26.5,130.75 v26.5,136 | X17.11 83,71 83,72 66.75,72 47.5,91.25 v47.5,107.5
IN8  (via drill 0.3)
  top 0.254: v27,139.5 IC1.35 | v50,125.75 51.25,125.75 60,117 60,115.75 57,112.75 57,111 63.25,104.75 71.25,104.75 77,99 77,79 X17.9
  route 0.254: v27,139.5 36.25,139.5 v50,125.75
IN9
  top 0.254: IC2.23 43,139 41.25,140.75 18.25,140.75 16,138.5 16,135.75 19,132.75 19,127 30,116 30,90 49,71 84.5,71 85,71.5 85,73 X17.7
IN10  (via drill 0.3)
  top 0.254: IC2.24 43.5,137 v43.25,136.75 | v49.25,130.75 49.25,123.75 57,116 v54,113
  route 0.254: v49.25,130.75 v43.25,136.75 | X17.5 63.5,76 48,91.5 48,107 v54,113
IN11  (via drill 0.3)
  top 0.254: v44.5,139.5 IC2.26 | v51,127 60.5,117.5 60.5,115.5 59.5,114.5 59.5,113.5 60,113 60,109 63.75,105.25 71.5,105.25 77.5,99.25 77.5,84.5 X17.3
  route 0.254: v44.5,139.5 44.5,139 42.5,137 42.5,135.5 v51,127
IN12  (via drill 0.3)
  top 0.254: v45,136.75 IC2.27 | v52.75,130.75 52.75,127.5 62,118.25 62,115 65,112 65,111.25 70.5,105.75 73.25,105.75 77.5,101.5 78,101.5 78,86 X17.1
  route 0.254: v45,136.75 46.25,136.75 48.25,134.75 48.75,134.75 v52.75,130.75
IN13  (via drill 0.3)
  top 0.254: v47,139.5 IC2.31 | v56.5,128.75 56.75,128.75 65,120.5 65,116 v63.5,114.5
  route 0.254: v47,139.5 56.5,130 v56.5,128.75 | X18.27 58.25,82 51,89.25 51,94 50.5,94.5 50.5,96.5 51.75,97.75 51.75,108.5 53.25,110 59,110 v63.5,114.5
IN14  (via drill 0.3)
  top 0.254: IC2.32 47.5,137 v47.25,136.75 | v53.75,130.75 55,129.5 56.75,129.5 65.5,120.75 65.5,111.5 70.75,106.25 75,106.25 79,102.25 79,99.75 80,98.75 80,96.25 81,95.25 81,92.75 82,91.75 82,89.25 83,88.25 83,85 X18.25
  route 0.254: v47.25,136.75 47.75,136.75 v53.75,130.75
IN15  (via drill 0.3)
  top 0.254: IC2.34 48.5,137 v49.25,136.25 | v54.75,130.75 56.25,130.75 66,121 66,116 69,113 69,110 72.25,106.75 75.25,106.75 79.5,102.5 79.5,100 80.5,99 80.5,96.5 81.5,95.5 81.5,93 82.5,92 82.5,89.5 X18.21
  route 0.254: v54.75,130.75 v49.25,136.25
IN16  (via drill 0.3)
  top 0.254: IC2.35 49,137.25 49.25,137 v51,137 | v57.25,130.75 64,124 64,123.75 70.5,117.25 70.5,115.5 79,107 79,103.75 80,102.75 80,100.25 81,99.25 81,96.75 82,95.75 82,93.25 83,92.25 83,91 X18.19
  route 0.254: v57.25,130.75 v51,137
IN17  (via drill 0.3)
  top 0.254: v65,139.5 IC3.23 | v64.5,130.75 64.5,124 71,117.5 71,115.75 79.5,107.25 79.5,104 80.5,103 80.5,100.5 81.5,99.5 81.5,97 82.5,96 82.5,93.5 X18.17
  route 0.254: v65,139.5 65,137.25 64.5,136.75 v64.5,130.75
IN18  (via drill 0.3)
  top 0.254: IC3.24 65.5,136.75 v65.25,136.5 | v65.25,130.25 65.25,125.75 80,111 80,104.25 81,103.25 81,100.75 82,99.75 82,97.25 83,96.25 83,95 X18.15
  route 0.254: v65.25,130.25 v65.25,136.5
IN19  (via drill 0.3)
  top 0.254: v66.5,139.5 IC3.26 | v66.25,130.75 66.25,125.75 80.5,111.5 80.5,104.5 81.5,103.5 81.5,101 82.5,100 82.5,97.5 X18.13
  route 0.254: v66.5,139.5 66.5,137.25 66.25,137 v66.25,130.75
IN20  (via drill 0.3)
  top 0.254: v67,136.75 IC3.27 | v74,130.5 74,118.75 81,111.75 81,104.75 82,103.75 82,101.25 83,100.25 83,99 X18.11
  route 0.254: v67,136.75 67.75,136.75 70.25,134.25 70.5,134.25 74,130.75 v74,130.5
IN21  (via drill 0.3)
  top 0.254: IC3.31 69,137 v68.75,136.75 | v74.75,130 74.75,118.75 81.5,112 81.5,105 82.5,104 82.5,101.5 X18.9
  route 0.254: v68.75,136.75 74.75,130.75 v74.75,130
IN22  (via drill 0.3)
  top 0.254: IC3.32 69.5,133.75 v69.25,133.5 | v75.5,127.25 75.5,118.75 82,112.25 82,105.25 83,104.25 83,103 X18.7
  route 0.254: v69.25,133.5 69.25,133 75,127.25 v75.5,127.25
IN23  (via drill 0.3)
  top 0.254: v70.5,139.5 IC3.34 | v76.25,129.75 76.25,118.75 82.5,112.5 82.5,105.5 X18.5
  route 0.254: v70.5,139.5 70.5,137.5 77,131 77,130.5 v76.25,129.75
IN24  (via drill 0.3)
  top 0.254: v71,136 IC3.35 | v76.25,130.75 77,130 77,118.75 83,112.75 83,107 X18.3
  route 0.254: v76.25,130.75 v71,136
IN25  (via drill 0.3)
  top 0.254: v87,139.5 IC4.23
  route 0.254: v87,139.5 87,137.25 83.5,133.75 83.5,124.25 83.25,124 83.25,116.75 X16.2
IN26  (via drill 0.3)
  top 0.254: IC4.24 87.5,136.75 v87.25,136.5
  route 0.254: v87.25,136.5 87.25,125.5 85.75,124 85.75,116.25 X16.4
IN27  (via drill 0.3)
  top 0.254: IC4.26 88.5,136.75 v88.75,136.5
  route 0.254: v88.75,136.5 88.75,124.5 88,123.75 X16.6
IN28  (via drill 0.3)
  top 0.254: v89,139.5 IC4.27
  route 0.254: v89,139.5 89,137.25 90.5,135.75 90.5,124.25 90.75,124 90.75,116.75 X16.8
IN29  (via drill 0.3)
  top 0.254: v91,136.5 IC4.31
  route 0.254: v91,136.5 91,126.25 93.25,124 93.25,117.25 X16.10
IN30  (via drill 0.3)
  top 0.254: IC4.32 91.5,139.25 v91.25,139.5
  route 0.254: v91.25,139.5 91.25,137.25 95.75,132.75 95.75,117.75 X16.12
IN31  (via drill 0.3)
  top 0.254: IC4.34 92.5,136.75 94.25,135 v94.5,135
  route 0.254: v94.5,135 98.25,131.25 98.25,118.25 X16.14
IN32  (via drill 0.3)
  top 0.254: IC4.35 93,137.25 v93.5,136.75
  route 0.254: v93.5,136.75 94.5,135.75 94.75,135.75 99.75,130.75 99.75,117.75 X16.16
IN33  (via drill 0.3)
  top 0.254: IC5.23 109,137.25 108.5,136.75 v107.75,136.75 | v103,126.5 101.5,125 101.25,125 100,123.75 X15.2
  route 0.254: v107.75,136.75 103.75,132.75 103.75,127.25 v103,126.5
IN34  (via drill 0.3)
  top 0.254: v109.5,139.5 IC5.24
  route 0.254: v109.5,139.5 109.5,137.5 104.25,132.25 104.25,126.75 102.25,124.75 101.25,124.75 100.5,124 100.5,117.5 X15.4
IN35  (via drill 0.3)
  top 0.254: v110.5,139.5 IC5.26
  route 0.254: v110.5,139.5 110.5,137.75 104.75,132 104.75,125.75 103,124 103,117 X15.6
IN36  (via drill 0.3)
  top 0.254: v111,136.5 IC5.27
  route 0.254: v111,136.5 111,126.75 108,123.75 108,118 X15.8
IN37  (via drill 0.3)
  top 0.254: v113,139.5 IC5.31
  route 0.254: v113,139.5 105.5,132 105.5,117 105,116.5 105,115.5 105.5,115 107,115 X15.10
IN38  (via drill 0.3)
  top 0.254: IC5.32 113.5,135.5 v111.75,133.75
  route 0.254: v111.75,133.75 111.75,125 110.5,123.75 110.5,116.5 X15.12
IN39  (via drill 0.3)
  top 0.254: v114.5,139.5 IC5.34
  route 0.254: v114.5,139.5 114.5,136.5 113.25,135.25 113.25,117.25 X15.14
IN40  (via drill 0.3)
  top 0.254: v115,136 IC5.35
  route 0.254: v115,136 115,124.5 115.5,124 115.5,117.5 X15.16
IN41  (via drill 0.3)
  top 0.254: IC6.23 131,139 v130.5,139.5 | v121.75,130.75 105.25,130.75 99,124.5 99,113.5 91.5,106 X18.4
  route 0.254: v121.75,130.75 v130.5,139.5
IN42  (via drill 0.3)
  top 0.254: v131.5,139.5 IC6.24 | v118.25,117.75 118.25,116.75 105.5,104 X18.6
  route 0.254: v131.5,139.5 131.5,137.25 118.25,124 v118.25,117.75
IN43  (via drill 0.3)
  top 0.254: IC6.26 132.5,137 v132.75,136.75 | v126.75,130.75 126.75,126.5 119,118.75 119,116.75 104.25,102 X18.8
  route 0.254: v126.75,130.75 v132.75,136.75
IN44  (via drill 0.3)
  top 0.254: v133,139.5 IC6.27 | v123,121.75 123,120 103,100 X18.10
  route 0.254: v133,139.5 133,138 123,128 v123,121.75
IN45  (via drill 0.3)
  top 0.254: v135,136.5 IC6.31 | v129.25,130.75 129.25,125.5 101.75,98 X18.12
  route 0.254: v129.25,130.75 v135,136.5
IN46  (via drill 0.3)
  top 0.254: v135.5,139.5 IC6.32 | v130,128.75 130,125.5 100.5,96 X18.14
  route 0.254: v135.5,139.5 135.5,138 128.5,131 128.5,130.25 v130,128.75
IN47  (via drill 0.3)
  top 0.254: IC6.34 136.5,136 v136,135.5 | v131.25,130.75 131.25,126 99.25,94 X18.16
  route 0.254: v131.25,130.75 v136,135.5
IN48  (via drill 0.3)
  top 0.254: v137,135.5 IC6.35
  route 0.254: v137,135.5 137,134.75 94.25,92 X18.18
IN49  (via drill 0.3)
  top 0.254: IC7.23 153,137 v153.25,136.75 | v139.5,136.75 v148.25,136.75
  route 0.254: v148.25,136.75 v153.25,136.75 | v139.5,136.75 137.5,134.75 137.5,134.5 93,90 X18.20
IN50  (via drill 0.3)
  top 0.254: v153.5,139.5 IC7.24 | v131.25,125 94.25,88 X18.22
  route 0.254: v153.5,139.5 145.75,139.5 v131.25,125
IN51  (via drill 0.3)
  top 0.254: IC7.26 154.5,136.75 v154.75,136.5 | v131.25,124 91.25,84 X18.26
  route 0.254: v154.75,136.5 154,136.5 141.5,124 v131.25,124
IN52  (via drill 0.3)
  top 0.254: v155,139.5 IC7.27 | v131.25,123 120.5,112.25 120.5,111.5 91,82 X18.28
  route 0.254: v155,139.5 155,137.25 155.5,136.75 155.5,136.25 154.75,135.5 154,135.5 141.5,123 v131.25,123
IN53  (via drill 0.3)
  top 0.254: v157,136.5 IC7.31 | v131.25,122 121,111.75 121,111.25 89.75,80 X17.2
  route 0.254: v157,136.5 156.5,136.5 155,135 154.25,135 141.25,122 v131.25,122
IN54  (via drill 0.3)
  top 0.254: v157.5,139.5 IC7.32 | v131.25,121 130.75,120.5 130.5,120.5 121.5,111.5 121.5,111 88.5,78 X17.4
  route 0.254: v157.5,139.5 157.5,137 157.75,136.75 157.75,136.25 157,135.5 156.25,135.5 155.25,134.5 154.5,134.5 141,121 v131.25,121
IN55  (via drill 0.3)
  top 0.254: IC7.34 158.5,136.25 v157,134.75 | v130.75,119.75 122,111 122,110.75 87.25,76 X17.6
  route 0.254: v157,134.75 156.25,134.75 155.5,134 154.75,134 140.75,120 131,120 v130.75,119.75
IN56  (via drill 0.3)
  top 0.254: IC7.35 159,135.75 156.5,133.25 v155.5,133.25 | X17.8 v130.75,118.75
  route 0.254: v155.5,133.25 154.75,133.25 141,119.5 131.5,119.5 v130.75,118.75
IN57  (via drill 0.3)
  top 0.254: IC8.23 175,137 v175.25,136.75 | X17.10 v131.25,117.25
  route 0.254: v175.25,136.75 161.75,136.75 144,119 133,119 v131.25,117.25
IN58  (via drill 0.3)
  top 0.254: IC8.24 175.5,139 175.25,139.25 173.25,139.25 172.25,138.25 v172.25,136 | v131.25,116.25 87,72 87,71 X17.12
  route 0.254: v172.25,136 161.75,136 144.25,118.5 133.5,118.5 v131.25,116.25
IN59  (via drill 0.3)
  top 0.254: IC8.26 176.5,136.75 v176.75,136.5 | v131.25,115.25 87.5,71.5 87.5,69.5 X17.14
  route 0.254: v176.75,136.5 176,136.5 159,119.5 146,119.5 144.5,118 134,118 v131.25,115.25
IN60  (via drill 0.3)
  top 0.254: v177,139.5 IC8.27 | v131.25,114.25 88.5,71.5 88.5,68.5 X17.16
  route 0.254: v177,139.5 177,137.25 177.5,136.75 177.5,136.25 176.75,135.5 176,135.5 159.5,119 146.75,119 145.25,117.5 134.5,117.5 v131.25,114.25
IN61  (via drill 0.3)
  top 0.254: v179,136.5 IC8.31 | v131.25,113.25 131.25,110 87,65.75 87,65 X17.18
  route 0.254: v179,136.5 178.5,136.5 177,135 176.25,135 159.75,118.5 147,118.5 145.5,117 135,117 v131.25,113.25
IN62  (via drill 0.3)
  top 0.254: v179.5,139.5 IC8.32 | v131.25,109 87.5,65.25 87.5,63.5 X17.20
  route 0.254: v179.5,139.5 179.5,137 179.75,136.75 179.75,136.25 178,134.5 176.5,134.5 160,118 147.25,118 138.25,109 v131.25,109
IN63  (via drill 0.3)
  top 0.254: IC8.34 180.5,136.25 178,133.75 v177,133.75 | v131.25,105 86.25,60 X17.22
  route 0.254: v177,133.75 176.5,133.75 160.25,117.5 147.5,117.5 135,105 v131.25,105
IN64  (via drill 0.3)
  top 0.254: v181,135.75 IC8.35 | v135,101 129,101 X17.24
  route 0.254: v181,135.75 180,135.75 161.25,117 151,117 v135,101
IN65  (via drill 0.3)
  top 0.254: X16.1 84,114.5 79.5,119 79.5,123.5 J7.8 | v51.75,119.75 v40.25,119.75 | IN65.1 7,111.75 10.75,108 R2.P$2
  route 0.254: v40.25,119.75 19.75,119.75 14,114 IN65.1 | v51.75,119.75 75.5,119.75 79.25,123.5 J7.8
IN66  (via drill 0.3)
  top 0.254: X16.3 86,114.5 85,115.5 85,120.5 82,123.5 J7.7 81.75,123.75 79,126.5 v78.25,126.5 | R4.P$2 20,108 16,112 IN66.1
  route 0.254: v78.25,126.5 56,126.5 48.5,119 28,119 23,114 IN66.1
IN67  (via drill 0.3)
  top 0.254: X16.5 88,114.5 87,115.5 87,121 J7.6 | v84.25,125.75 v81.5,125.75
  route 0.254: v81.5,125.75 56,125.75 48.25,118 36,118 32,114 IN67.1 24,113 24,107.75 24.75,107 24.75,105 R6.P$2 | v84.25,125.75 84.25,123.75 J7.6
IN68
  top 0.254: X16.7 90,114.5 89,115.5 89,121.5 87,123.5 J7.5 | IN68.1 33,113 33,108 R9.P$2
  route 0.254: X16.7 89,115 83.5,115 80,118.5 53.75,118.5 50.25,115 47,115 46.5,114.5 45.75,114.5 43.75,112.5 42.5,112.5 41,114 IN68.1
IN69  (via drill 0.3)
  top 0.254: X16.9 92,114.5 91,115.5 91,122 89.5,123.5 J7.4 89.25,123.75 88,125 84,125 83.75,124.75 v82.75,124.75 | IN69.1 43,108 R11.P$2
  route 0.254: v82.75,124.75 55.75,124.75 46,115 45.5,115 44.5,114 IN69.1
IN70  (via drill 0.3)
  top 0.254: J7.3 92.25,123.5 93,122.75 93,115.5 94,114.5 X16.11 91.25,111.25 v86.25,111.25 | IN70.1 52.75,113.25 52.75,108 R13.P$2
  route 0.254: v86.25,111.25 84.25,111.25 79.5,106.5 55.25,106.5 53.75,108 R13.P$2
IN71  (via drill 0.3)
  top 0.254: J7.2 94.75,123.5 95,123.25 95,115.5 96,114.5 X16.13 93.75,111.75 v92.75,111.75 | IN71.1 61,112 62.75,110.25 62.75,108 R17.P$2
  route 0.254: v92.75,111.75 92.5,112 83.75,112 78.75,107 64.75,107 63.75,108 R17.P$2
IN72
  top 0.254: X16.15 98,114.5 97,115.5 97,123.5 J7.1 | IN72.1 70,112 72.75,109.25 72.75,108 R19.P$2
  route 0.254: X16.15 96.5,112.5 83.25,112.5 81.75,114 75.75,108 R19.P$2
IN73  (via drill 0.3)
  top 0.254: J8.8 101.5,123.5 101,123 101,115.5 100,114.5 X15.1 100,113.5 v93.5,107 | IN73.1 7,92.75 10.75,89 R3.P$2 | v36.25,90 39,92.75 39,93 45.25,99.25 v75.75,99.25
  route 0.254: v93.5,107 83.5,107 v75.75,99.25 | R3.P$2 11.75,89 12.75,90 v36.25,90
IN74  (via drill 0.3)
  top 0.254: X15.3 102,114.5 103,115.5 103,122.25 104.25,123.5 J8.7 104.25,123.75 104.25,126.25 v103,127.5 | R5.P$2 20,89 16,93 IN74.1
  route 0.254: v103,127.5 103,128.75 91.5,140.25 20.75,140.25 3,122.5 3,111 16,98 IN74.1
IN75
  top 0.254: X15.5 104,114.5 105,115.5 105,121.75 106.75,123.5 J8.6 | IN75.1 25,102 R7.P$2
  route 0.254: X15.5 103,115 95.5,115 95,114.5 95,113.5 94.5,113 83.5,113 78.5,118 54,118 50,114 46,114 34,102 R7.P$2
IN76  (via drill 0.3)
  top 0.254: J8.5 109.25,123.5 107,121.25 107,115.5 106,114.5 X15.7 101,109 v101,108 | 33,89 33,94 IN76.1 | 33,89 34.25,87.75 73.5,87.75 76.25,90.5 v76.25,91.25 | 33,89 R10.P$2
  route 0.254: v101,108 88,95 83.5,95 79.75,91.25 v76.25,91.25
IN77  (via drill 0.3)
  top 0.254: J8.4 111.75,123.5 109,120.75 109,115.5 108,114.5 X15.9 101.25,107.25 v99.25,107.25 | IN77.1 43,91 | 43,91 43,89 R12.P$2 | v51.75,91 43,91
  route 0.254: v99.25,107.25 89,97 81,97 75,91 v51.75,91
IN78  (via drill 0.3)
  top 0.254: J8.3 114.25,123.5 111,120.25 111,115.5 110,114.5 X15.11 v103.25,107.25 | IN78.1 52.75,94.25 52.75,89 R14.P$2
  route 0.254: v103.25,107.25 89,93 83.5,93 81,90.5 55.25,90.5 53.75,89 R14.P$2
IN79
  top 0.254: X15.13 112,114.5 113,115.5 113,119.75 116.75,123.5 J8.2 | IN79.1 61,93 62.75,91.25 62.75,89 R18.P$2
  route 0.254: J8.2 116.75,123.5 116.75,115.25 111.5,110 84.5,110 75,100.5 75,98 70.5,93.5 69.5,93.5 68,95 IN79.1
IN80
  top 0.254: X15.15 114,114.5 119.5,120 J8.1 | IN80.1 70,93 72.75,90.25 72.75,89 R20.P$2
  route 0.254: X15.15 113,113 103.25,113 100.75,110.5 84.25,110.5 74.75,101 74,101 70,97 IN80.1
IO1  (via drill 0.3)
  top 0.254: v144.25,120.25 v137.75,113.75
  route 0.254: X13.11 132,98.5 130.5,100 130.5,109.25 133,111.75 135.75,111.75 v137.75,113.75 | v144.25,120.25 165.75,141.75 181.25,141.75 191,151.5 191,154 J12.1
IO2  (via drill 0.3)
  top 0.254: v140,114.75 161.5,114.75 v171.5,124.75
  route 0.254: X13.13 132,96.5 130,98.5 130,109.5 135.25,114.75 v140,114.75 | v171.5,124.75 193.5,146.75 193.5,154 J12.2
IO3  (via drill 0.3)
  top 0.254: v128.25,97.75 X13.15
  route 0.254: v128.25,97.75 128.25,121.25 130.5,123.5 130.5,125.25 147,141.75 165,141.75 175.5,152.25 175.5,155.5 176.25,156.25 200.75,156.25 203,154 J4.1
IO4  (via drill 0.3)
  top 0.254: v140.5,115.5 161.25,115.5 v168.25,122.5
  route 0.254: X13.17 132,92.5 129.5,95 129.5,109.75 135.25,115.5 v140.5,115.5 | v168.25,122.5 174,122.5 205.5,154 J4.2
IO5  (via drill 0.3)
  top 0.254: v155.5,116.25 v141.75,116.25
  route 0.254: X13.19 132,90.5 129,93.5 129,110 135.25,116.25 v141.75,116.25 | v155.5,116.25 174.5,116.25 212.25,154 J3.1
IO6
  route 0.254: X13.21 132,88.5 133,89.5 133,96.5 133.5,97 138.25,97 149,107.75 171.5,107.75 217.75,154 J3.2
IO7
  route 0.254: X13.25 132,84.5 133,85.5 133,86.5 132.5,87 131.5,87 127.5,91 127.5,123.75 156,152.25 156,155.5 157.25,156.75 217.5,156.75 220.25,154 J3.3
IO8
  top 0.254: X14.1 132.5,80 133.5,79 144.25,79 145,79.75 J14.8
IO9
  top 0.254: X14.3 132.5,78 133.5,77 145,77 J14.7
IO10
  route 0.254: X14.5 132.5,76 133.5,75 144.75,75 145,74.75 J14.6
IO11
  route 0.254: X14.7 132.5,74 133.5,73 144.25,73 145,72.25 J14.5
IO12
  route 0.254: X14.9 132.5,72 133.5,71 143.75,71 145,69.75 J14.4
IO13
  route 0.254: X14.11 132.5,70 133.5,69 143.25,69 145,67.25 J14.3
IO14
  route 0.254: X14.13 132.5,68 133.5,67 142.75,67 145,64.75 J14.2
IO15
  route 0.254: X14.15 132.5,66 133.5,65 142,65 J14.1
IO16
  top 0.254: X14.2 143.25,80 144.25,81 149,81 150,80 J15.8
IO17
  top 0.254: X14.4 144,78 144.5,78.5 148.75,78.5 J15.7
IO18
  top 0.254: X14.6 148.75,76 150,74.75 J15.6
IO19
  route 0.254: X14.8 144,74 144.75,73.25 149,73.25 150,72.25 J15.5
IO20
  route 0.254: X14.10 143.5,72 144.75,70.75 149,70.75 150,69.75 J15.4
IO21
  route 0.254: X14.12 143,70 144.75,68.25 149,68.25 150,67.25 J15.3
IO22
  route 0.254: X14.14 142.5,68 144.75,65.75 149,65.75 150,64.75 J15.2
IO23
  route 0.254: X14.16 142,66 144.75,63.25 148.75,63.25 J15.1
N$1
  top 0.254: IC2.1 50.5,148.25 54.75,152.5 JP2.1
N$2
  top 0.254: IC2.2 50,148.75 53.75,152.5 53.75,154 54.75,155 JP2.2
N$3
  top 0.254: IC2.3 49.5,149.75 52.25,152.5 JP2.3
N$4
  top 0.254: IC2.4 49,150.25 51.25,152.5 51.25,154 52.25,155 JP2.4
N$5
  top 0.254: IC2.6 48,150.75 49.75,152.5 JP2.5
N$6
  top 0.254: IC2.7 47.5,151.25 48.75,152.5 48.75,154 49.75,155 JP2.6
N$7
  top 0.254: IC2.8 47,152.25 47.25,152.5 JP2.7
N$8
  top 0.254: IC2.9 46.5,151.75 46,152.25 46,153.75 47.25,155 JP2.8
N$9
  top 0.254: IC1.1 28.5,148.25 32.75,152.5 JP1.1
N$10
  top 0.254: IC1.2 28,148.75 31.75,152.5 31.75,154 32.75,155 JP1.2
N$11
  top 0.254: IC1.3 27.5,149.75 30.25,152.5 JP1.3
N$12
  top 0.254: IC1.4 27,150.25 29.25,152.5 29.25,154 30.25,155 JP1.4
N$13
  top 0.254: IC1.6 26,150.75 27.75,152.5 JP1.5
N$14
  top 0.254: IC1.7 25.5,151.25 26.75,152.5 26.75,154 27.75,155 JP1.6
N$15
  top 0.254: IC1.8 25,152.25 25.25,152.5 JP1.7
N$16
  top 0.254: IC1.9 24.5,151.75 24,152.25 24,153.75 25.25,155 JP1.8
N$17
  top 0.254: IC1.11 23.5,151.75 22.75,152.5 JP1.9
N$18
  top 0.254: IC1.12 23,150.75 21.5,152.25 21.5,154 22.5,155 JP1.10
N$19
  top 0.254: IC1.13 22.5,150.25 20.25,152.5 JP1.11
N$20
  top 0.254: IC1.14 22,143 21.25,142.25 19,142.25 13,148.25 13,155.5 14.25,156.75 18.5,156.75 20,155.25 JP1.12
N$21
  top 0.254: IC1.16 21,145 20.5,145.5 20.5,149.75 17.75,152.5 JP1.13
N$22
  top 0.254: IC1.17 20.5,143 20.25,142.75 19.25,142.75 13.5,148.5 13.5,155.25 14.5,156.25 16.5,156.25 17.5,155.25 JP1.14
N$23
  top 0.254: IC1.18 20,147.75 15.25,152.5 JP1.15
N$24
  top 0.254: IC1.19 19.5,146.75 14,152.25 14,154 15,155 JP1.16
N$25
  top 0.254: IC2.11 45.5,151.75 44.75,152.5 JP2.9
N$26
  top 0.254: IC2.12 45,150.75 43.5,152.25 43.5,154 44.5,155 JP2.10
N$27
  top 0.254: IC2.13 44.5,150.25 42.25,152.5 JP2.11
N$28
  top 0.254: IC2.14 44,149.25 41,152.25 41,154 JP2.12
N$29
  top 0.254: IC2.16 43,149.25 39.75,152.5 JP2.13
N$30
  top 0.254: IC2.17 42.5,148.25 38.5,152.25 38.5,154 39.5,155 JP2.14
N$31
  top 0.254: IC2.18 42,147.75 37.25,152.5 JP2.15
N$32
  top 0.254: IC2.19 41.5,146.75 36,152.25 36,154 37,155 JP2.16
N$33
  top 0.254: IC3.1 72.5,148.25 76.75,152.5 JP3.1
N$34
  top 0.254: IC3.2 72,148.75 75.75,152.5 75.75,154 76.75,155 JP3.2
N$35
  top 0.254: IC3.3 71.5,149.75 74.25,152.5 JP3.3
N$36
  top 0.254: LEDPOW.C 202.5,143 204.25,144.75 214,144.75 214.75,144 214.75,142 211,138.25 207.5,138.25 207,137.75 207,135.5 206.75,135.25 198.75,135.25 197,137 RLEDPOW.1
N$37
  top 0.254: IC3.4 71,150.25 73.25,152.5 73.25,154 74.25,155 JP3.4
N$38
  top 0.254: IC3.6 70,150.75 71.75,152.5 JP3.5
N$39
  top 0.254: IC3.7 69.5,151.25 70.75,152.5 70.75,154 71.75,155 JP3.6
N$40
  top 0.254: IC3.8 69,152.25 69.25,152.5 JP3.7
N$41
  top 0.254: IC3.9 68.5,151.75 68,152.25 68,153.75 69.25,155 JP3.8
N$42
  top 0.254: IC3.11 67.5,151.75 66.75,152.5 JP3.9
N$43
  top 0.254: IC3.12 67,150.75 65.5,152.25 65.5,154 66.5,155 JP3.10
N$44
  top 0.254: IC3.13 66.5,150.25 64.25,152.5 JP3.11
N$45
  top 0.254: IC3.14 66,149.25 63,152.25 63,154 JP3.12
N$46
  top 0.254: IC3.16 65,149.25 61.75,152.5 JP3.13
N$47
  top 0.254: IC3.17 64.5,148.25 60.5,152.25 60.5,154 61.5,155 JP3.14
N$48
  top 0.254: IC3.18 64,147.75 59.25,152.5 JP3.15
N$49
  top 0.254: IC3.19 63.5,146.75 58,152.25 58,154 59,155 JP3.16
N$50
  top 0.254: IC4.1 94.5,148.25 98.75,152.5 JP4.1
N$51
  top 0.254: IC4.2 94,148.75 97.75,152.5 97.75,154 98.75,155 JP4.2
N$52
  top 0.254: IC4.3 93.5,149.75 96.25,152.5 JP4.3
N$53  (via drill 0.3)
  top 0.254: v93,142.5 IC4.4
  route 0.254: v93,142.5 93,145 95.25,147.25 95.25,154 96.25,155 JP4.4
N$54
  top 0.254: IC4.6 92,145 91.75,145.25 91.75,150.5 93.75,152.5 JP4.5
N$55
  top 0.254: IC4.7 91.5,143 92.75,141.75 93.75,141.75 100,148 100,155.75 99.5,156.25 95,156.25 94,155.25 JP4.6
N$56
  top 0.254: IC4.8 91,152.25 91.25,152.5 JP4.7
N$57
  top 0.254: IC4.9 90.5,151.75 90,152.25 90,153.75 91.25,155 JP4.8
N$58
  top 0.254: IC4.11 89.5,151.75 88.75,152.5 JP4.9
N$59
  top 0.254: IC4.12 89,150.75 87.5,152.25 87.5,154 88.5,155 JP4.10
N$60
  top 0.254: IC4.13 88.5,150.25 86.25,152.5 JP4.11
N$61
  top 0.254: IC4.14 88,143 87.25,142.25 85,142.25 79,148.25 79,155.5 80.25,156.75 84.5,156.75 86,155.25 JP4.12
N$62
  top 0.254: IC4.16 87,145 86.5,145.5 86.5,149.75 83.75,152.5 JP4.13
N$63
  top 0.254: IC4.17 86.5,143 86.25,142.75 85.25,142.75 79.5,148.5 79.5,155.25 80.5,156.25 82.5,156.25 83.5,155.25 JP4.14
N$64
  top 0.254: IC4.18 86,147.75 81.25,152.5 JP4.15
N$65
  top 0.254: IC4.19 85.5,146.75 80,152.25 80,154 81,155 JP4.16
N$66
  top 0.254: IC5.1 116.5,148.25 120.75,152.5 JP5.1
N$67
  top 0.254: IC5.2 116,148.75 119.75,152.5 119.75,154 120.75,155 JP5.2
N$68
  top 0.254: IC5.3 115.5,149.75 118.25,152.5 JP5.3
N$69
  top 0.254: IC5.4 115,150.25 117.25,152.5 117.25,154 118.25,155 JP5.4
N$70
  top 0.254: IC5.6 114,150.75 115.75,152.5 JP5.5
N$71
  top 0.254: IC5.7 113.5,151.25 114.75,152.5 114.75,154 115.75,155 JP5.6
N$72
  top 0.254: IC5.8 113,152.25 113.25,152.5 JP5.7
N$73
  top 0.254: IC5.9 112.5,151.75 112,152.25 112,153.75 113.25,155 JP5.8
N$74
  top 0.254: IC5.11 111.5,151.75 110.75,152.5 JP5.9
N$75
  top 0.254: IC5.12 111,150.75 109.5,152.25 109.5,154 110.5,155 JP5.10
N$76
  top 0.254: IC5.13 110.5,150.25 108.25,152.5 JP5.11
N$77
  top 0.254: IC5.14 110,149.25 107,152.25 107,154 JP5.12
N$78
  top 0.254: IC5.16 109,149.25 105.75,152.5 JP5.13
N$79
  top 0.254: IC5.17 108.5,148.25 104.5,152.25 104.5,154 105.5,155 JP5.14
N$80
  top 0.254: IC5.18 108,147.75 103.25,152.5 JP5.15
N$81
  top 0.254: IC5.19 107.5,146.75 102,152.25 102,154 103,155 JP5.16
N$82
  top 0.254: IC6.1 138.5,148.25 142.75,152.5 JP6.1
N$83